# EAGLE design 6_LIN (EAGLE 7.7.0)
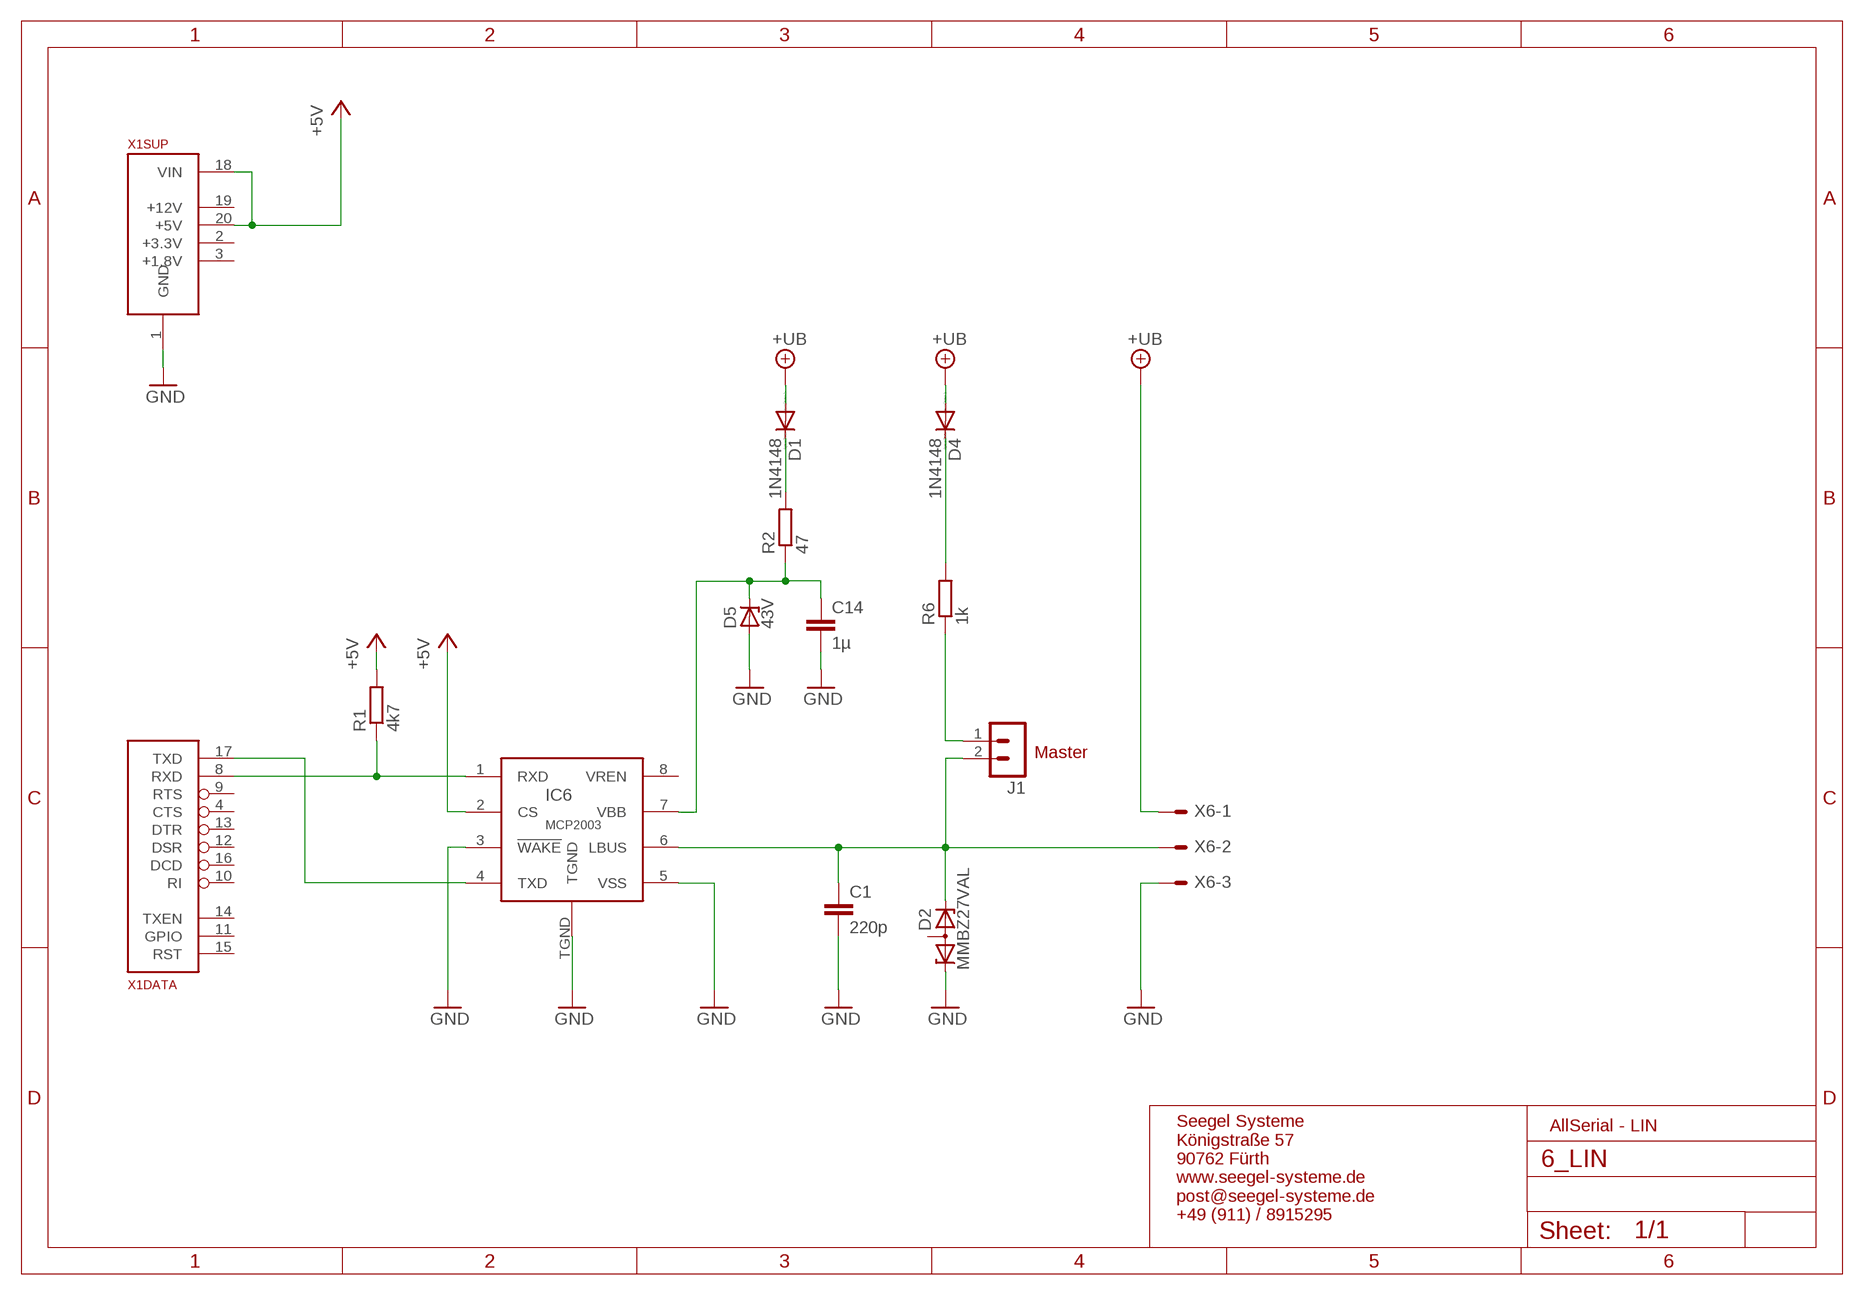
[diagram p0: schematic, sheet 1]

## Parts
C1  220p  C-EUC0805  [C0805]
C14  1µ  C-EUC0805  [C0805]
D1  1N4148  DIODE-MINIMELF  [MINIMELF]
D2  MMBZ27VAL  [SOT23]
D4  1N4148  DIODE-MINIMELF  [MINIMELF]
D5  43V  ZENER-DIODESOD80C  [SOD80C]
IC6  MCP2003  [SOIC8T]
J1  MA02-1W  [MA02-W]
R1  4k7  R-EU_R0805  [R0805]
R2  47  R-EU_R0805  [R0805]
R6  1k  R-EU_R0805  [R0805]
X1  ALLSERIALSLAVE  [DAUGHTER-THT]
X6  AKL18X-03W  [AKL182-03]

## Nets
+5V: IC6.2(CS) R1.2 X1.18(SUP:VIN) X1.20(SUP:+5V)
+UB: D1.A D4.A X6.P$1
GND: C1.2 C14.2 D2.1(K1) D5.A IC6.3(!WAKE) IC6.5(VSS) IC6.TGND X1.1(SUP:GND) X6.P$3
N$1: D1.C R2.2
N$2: D4.C R6.2
N$3: C14.1 D5.C IC6.7(VBB) R2.1
N$73: C1.1 D2.2(K2) IC6.6(LBUS) J1.2 X6.P$2
N$74: J1.1 R6.1
N$77: IC6.4(TXD) X1.17(DATA:TXD)
N$79: IC6.1(RXD) R1.1 X1.8(DATA:RXD)
Unconnected: D2.3(A) IC6.8(VREN) X1.2(SUP:+3.3V) X1.3(SUP:+1.8V) X1.4(DATA:CTS) X1.5(USB:D-) X1.6(USB:D+) X1.7(USB:VUSB) X1.9(DATA:RTS) X1.10(DATA:RI) X1.11(DATA:GPIO) X1.12(DATA:DSR) X1.13(DATA:DTR) X1.14(DATA:TXEN) X1.15(DATA:RST) X1.16(DATA:DCD) X1.19(SUP:+12V)

## Notes on the sheet
- Master
- AllSerial - LIN
- Seegel Systeme
  Königstraße 57
  90762 Fürth
  www.seegel-systeme.de
  post@seegel-systeme.de
  +49 (911) / 8915295

## Library data of the parts
C1 C14 = rcl:C-EU: CAPACITOR, European symbol
D1 D4 = diode:DIODE-: DIODE
D2 = diode:MMBZ*AL
D5 = diode:ZENER-DIODE: Z-Diode
IC6 = freetronics-jon:MCP2003
J1 = con-lstb:MA02-1W
R1 R2 R6 = rcl:R-EU_: RESISTOR, European symbol
X1 = AllSerialv2:ALLSERIALSLAVE
X6 = con-riacon_akl:AKL18X-03: Riacon AKL18X Steckverbinder 3-Pol Grid = 3,5mm

## Board
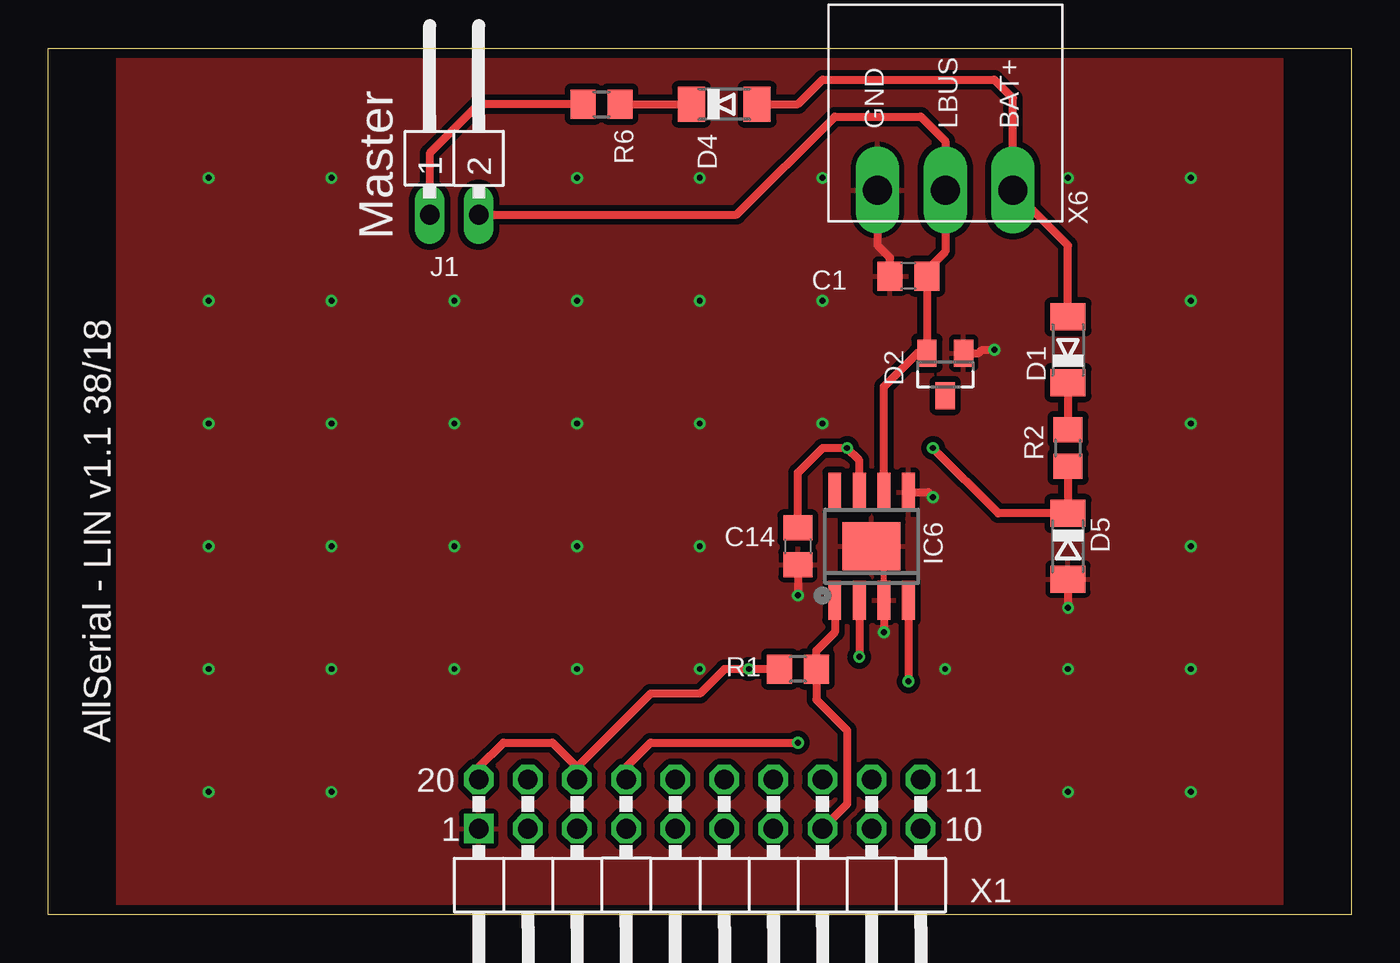
[diagram p1: board, top side]
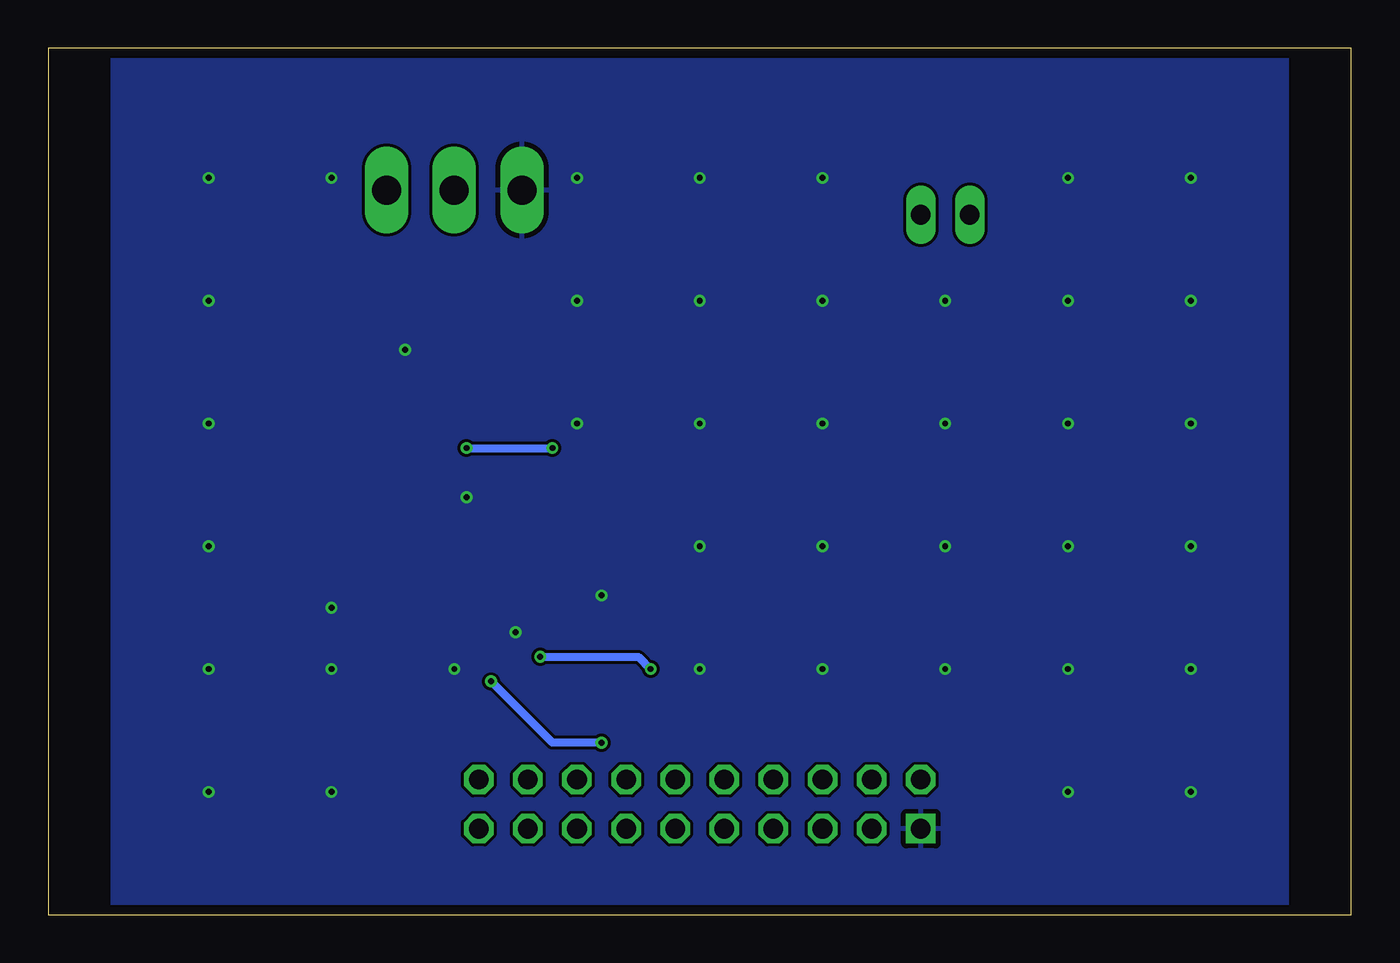
[diagram p2: board, bottom side, seen from below]

Size 67.4 x 44.8 mm. Coordinates in mm from the lower left corner, seen from the top.
Copper layers (1*16): Top 0.035mm / dielectric 1.6mm / Bottom 0.035mm
Design rules "Elecrow_2-layer_PCB_eagle_rule *": minimum track width 6mil, minimum drill 0.3mm, track to track 6mil, track to pad 6mil, pad to pad 6mil, via to via 8mil, smd to smd 0mil, copper to edge 20mil, drill to drill 10mil, minimum pad ring 6mil, minimum via ring 6mil, stop-mask expansion 0mil, vias tented up to drill 0.3mm, thermal gap 10mil

### Footprints (pad centres in the part's own frame; a part is rotated, then mirrored left to right if it is on the bottom)
C0805 = smd 1.3 x 1.5: 1 -0.95,0; 2 0.95,0
MINIMELF = smd 1.4 x 1.8: A 1.7,0; C -1.7,0
SOT23 = smd 1 x 1.4: 1 -0.95,-1.1; 2 0.95,-1.1; 3 0,1.1
SOD80C = smd 1.4 x 1.8: A 1.7,0; C -1.7,0
SOIC8T = smd 2.032 x 0.66: 1 -2.794,1.905; 2 -2.794,0.635; 3 -2.794,-0.635; 4 -2.794,-1.905; 5 2.794,-1.905; 6 2.794,-0.635; 7 2.794,0.635; 8 2.794,1.905 | smd 2.489 x 2.997: TGND 0,0
MA02-W = drill 1.016 long: 1 -1.27,0; 2 1.27,0
R0805 = smd 1.3 x 1.5: 1 -0.95,0; 2 0.95,0
DAUGHTER-THT = drill 1.016 square: 1 -11.43,4.445 | drill 1.016 octagon: 2 -8.89,4.445; 3 -6.35,4.445; 4 -3.81,4.445; 5 -1.27,4.445; 6 1.27,4.445; 7 3.81,4.445; 8 6.35,4.445; 9 8.89,4.445; 10 11.43,4.445; 11 11.43,6.985; 12 8.89,6.985; 13 6.35,6.985; 14 3.81,6.985; 15 1.27,6.985; 16 -1.27,6.985; 17 -3.81,6.985; 18 -6.35,6.985; 19 -8.89,6.985; 20 -11.43,6.985
AKL182-03 = drill 1.5 pad 2.184 long: P$1 -3.5,0; P$2 0,0; P$3 3.5,0

### Placement (x,y rotation side)
C1  44.5,33.02 180 top
C14  38.78,19.05 270 top
D1  52.75,29.21 90 top
D2  46.4,27.94 180 top
D4  34.97,41.91 0 top
D5  52.75,19.05 270 top
IC6  42.59,19.05 90 top
J1  21,36.2 0 top
R1  38.78,12.7 180 top
R2  52.75,24.13 90 top
R6  28.62,41.91 0 top
X1  33.7,0 0 top
X6  46.4,37.47 180 top

### Tracks (layer width: path | path; a pad name or v marks a point on that pad's centre or on a via)
+5V  (via drill 0.3)
  Top 0.406: IC6.2 v41.96,13.34 | X1.20 22.27,7.62 23.54,8.89 26.08,8.89 27.35,7.62 | 27.35,7.62 X1.18 | R1.2 v36.24,12.7 34.97,12.7 33.7,11.43 31.16,11.43 27.35,7.62
  Bottom 0.406: v41.96,13.34 36.88,13.34 v36.24,12.7
+UB
  Top 0.406: D4.A 38.78,41.91 40.05,43.18 48.94,43.18 49.9,42.22 X6.P$1 52.75,34.62 D1.A
GND  (via drill 0.3)
  Top 0.305: IC6.3 43.23,18.41 IC6.TGND
  Top 0.406: IC6.3 v43.23,14.61 | X6.P$3 42.9,34.62 43.55,33.97 C1.2 | D2.1 48.14,29.04 48.31,29.21 v48.94,29.21 | D5.A v52.75,15.88 | IC6.5 45.51,21.84 v45.77,21.59 | C14.2 v38.78,16.51
  other vias: 8.3,38.1 8.3,31.75 8.3,25.4 8.3,19.05 8.3,12.7 8.3,6.35 59.1,38.1 59.1,31.75 59.1,25.4 59.1,19.05 59.1,12.7 59.1,6.35 14.65,31.75 14.65,25.4 14.65,19.05 14.65,12.7 21,31.75 21,25.4 21,19.05 21,12.7 27.35,31.75 27.35,25.4 27.35,19.05 27.35,12.7 33.7,31.75 33.7,25.4 33.7,19.05 33.7,12.7 14.65,6.35 14.65,38.1 52.75,38.1 52.75,6.35 46.4,12.7 40.05,31.75 40.05,25.4 27.35,38.1 33.7,38.1 40.05,38.1 52.75,12.7
  pour Bottom: -0.59,44.45 67.99,44.45 67.99,0 -0.59,0
  pour Top (isolate 0.305): -0.59,0 67.99,0 67.99,45.72 -0.59,45.72
N$1
  Top 0.406: D1.C R2.2
N$2
  Top 0.406: R6.2 D4.C
N$3  (via drill 0.3)
  Top 0.406: R2.1 D5.C 49.15,20.75 v45.77,24.13 | C14.1 38.78,22.86 40.05,24.13 v41.32,24.13 41.96,23.5 IC6.7
  Bottom 0.406: v45.77,24.13 v41.32,24.13
N$73
  Top 0.305: 46.4,39.37 X6.P$2
  Top 0.406: X6.P$2 46.4,34.29 45.45,33.34 C1.1 D2.2 44.96,29.04 43.23,27.3 IC6.6 | J1.2 35.61,36.2 40.69,41.27 45.13,41.27 46.4,40.01 46.4,39.37
N$74
  Top 0.406: R6.1 22.27,41.91 19.73,39.37 J1.1
N$77  (via drill 0.3)
  Top 0.406: IC6.4 v44.5,12.06 | X1.17 29.89,7.62 31.16,8.89 v38.78,8.89
  Bottom 0.406: v38.78,8.89 41.32,8.89 v44.5,12.06
N$79
  Top 0.406: IC6.1 40.69,14.61 39.73,13.65 R1.1 39.73,11.12 41.32,9.53 41.32,5.71 X1.8

### Text on the board
tPlace: GND | LBUS | BAT+ | Master | AllSerial - LIN v1.1 38/18